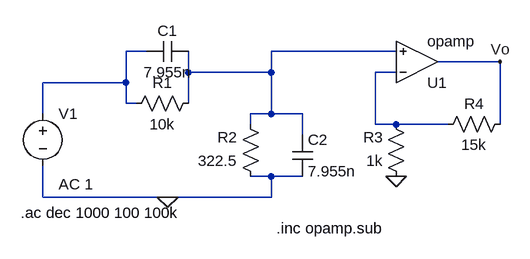
[diagram p0: schematic Ej5.asc]
Ej5.asc, the LTspice schematic file:
Version 4
SHEET 1 880 680
WIRE 80 112 48 112
WIRE 464 112 272 112
WIRE 624 128 528 128
WIRE 144 144 144 112
WIRE 272 144 272 112
WIRE 272 144 144 144
WIRE 464 144 432 144
WIRE 48 160 48 112
WIRE 48 160 -80 160
WIRE 48 192 48 160
WIRE 64 192 48 192
WIRE 144 192 144 144
WIRE -80 208 -80 160
WIRE 272 208 272 144
WIRE 272 208 240 208
WIRE 320 208 272 208
WIRE 240 224 240 208
WIRE 432 224 432 144
WIRE 464 224 432 224
WIRE 544 224 464 224
WIRE 624 224 624 128
WIRE 320 240 320 208
WIRE 272 304 240 304
WIRE 320 304 272 304
WIRE -80 336 -80 288
WIRE 112 336 -80 336
WIRE 272 336 272 304
WIRE 272 336 112 336
FLAG 112 336 0
FLAG 624 128 Vo
FLAG 464 304 0
SYMBOL cap 144 96 R90
WINDOW 0 0 32 VBottom 2
WINDOW 3 32 32 VTop 2
SYMATTR InstName C1
SYMATTR Value 7.955n
SYMBOL res 160 176 R90
WINDOW 0 0 56 VBottom 2
WINDOW 3 32 56 VTop 2
SYMATTR InstName R1
SYMATTR Value 10k
SYMBOL res 256 320 R180
WINDOW 0 36 76 Left 2
WINDOW 3 36 40 Left 2
SYMATTR InstName R2
SYMATTR Value 322.5
SYMBOL cap 304 240 R0
SYMATTR InstName C2
SYMATTR Value 7.955n
SYMBOL voltage -80 192 R0
WINDOW 123 24 124 Left 2
WINDOW 39 0 0 Left 0
SYMATTR InstName V1
SYMATTR Value ""
SYMATTR Value2 AC 1
SYMBOL OpAmps\\opamp 496 192 M180
SYMATTR InstName U1
SYMBOL res 480 320 R180
WINDOW 0 36 76 Left 2
WINDOW 3 36 40 Left 2
SYMATTR InstName R3
SYMATTR Value 1k
SYMBOL res 528 240 R270
WINDOW 0 32 56 VTop 2
WINDOW 3 0 56 VBottom 2
SYMATTR InstName R4
SYMATTR Value 15k
TEXT -114 360 Left 2 !.ac dec 1000 100 100k
TEXT 280 384 Left 2 !.inc opamp.sub

The netlist it stands for:
* Ej5.asc
C1 N002 N001 7.955n
R1 N002 N001 10k
R2 0 N002 322.5
C2 N002 0 7.955n
V1 N001 0 AC 1
XU1 N003 N002 Vo opamp Aol=100K GBW=10Meg  ; pins invin noninvin out
R3 0 N003 1k
R4 N003 Vo 15k
.ac dec 1000 100 100k
.inc opamp.sub
.backanno
.end